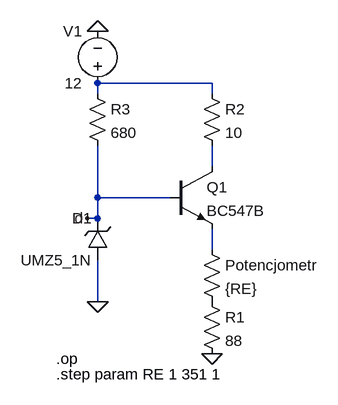
[diagram p0: schematic lista7_zad1.asc]
lista7_zad1.asc, the LTspice schematic file:
Version 4.1
SHEET 1 880 680
WIRE 272 -16 96 -16
WIRE 96 0 96 -16
WIRE 272 0 272 -16
WIRE 272 112 272 80
WIRE 96 160 96 80
WIRE 208 160 96 160
WIRE 96 192 96 160
WIRE 96 192 80 192
WIRE 272 240 272 208
WIRE 96 320 96 256
FLAG 272 400 0
FLAG 96 320 0
FLAG 96 -96 0
FLAG 80 192 d
SYMBOL npn 208 112 R0
SYMATTR InstName Q1
SYMATTR Value BC547B
SYMBOL res 256 304 R0
SYMATTR InstName R1
SYMATTR Value 88
SYMBOL res 256 -16 R0
SYMATTR InstName R2
SYMATTR Value 10
SYMBOL zener 112 256 R180
WINDOW 0 24 64 Left 2
WINDOW 3 24 0 Left 2
SYMATTR InstName D1
SYMATTR Value UMZ5_1N
SYMBOL res 80 -16 R0
SYMATTR InstName R3
SYMATTR Value 680
SYMBOL voltage 96 0 R180
WINDOW 0 24 96 Left 2
WINDOW 3 24 16 Left 2
WINDOW 123 0 0 Left 0
WINDOW 39 0 0 Left 0
SYMATTR InstName V1
SYMATTR Value 12
SYMBOL res 256 224 R0
SYMATTR InstName Potencjometr
SYMATTR Value {RE}
TEXT 32 408 Left 2 !.op
TEXT 32 432 Left 2 !.step param RE 1 351 1

The netlist it stands for:
* lista7_zad1.asc
Q1 N002 d N003 0 BC547B
R1 P001 0 88
R2 N001 N002 10
D1 0 d UMZ5_1N
R3 N001 d 680
V1 N001 0 12
R§Potencjometr N003 P001 {RE}
.model D D
.lib standard.dio
.model NPN NPN
.model PNP PNP
.lib standard.bjt
.op
.step param RE 1 351 1
.backanno
.end